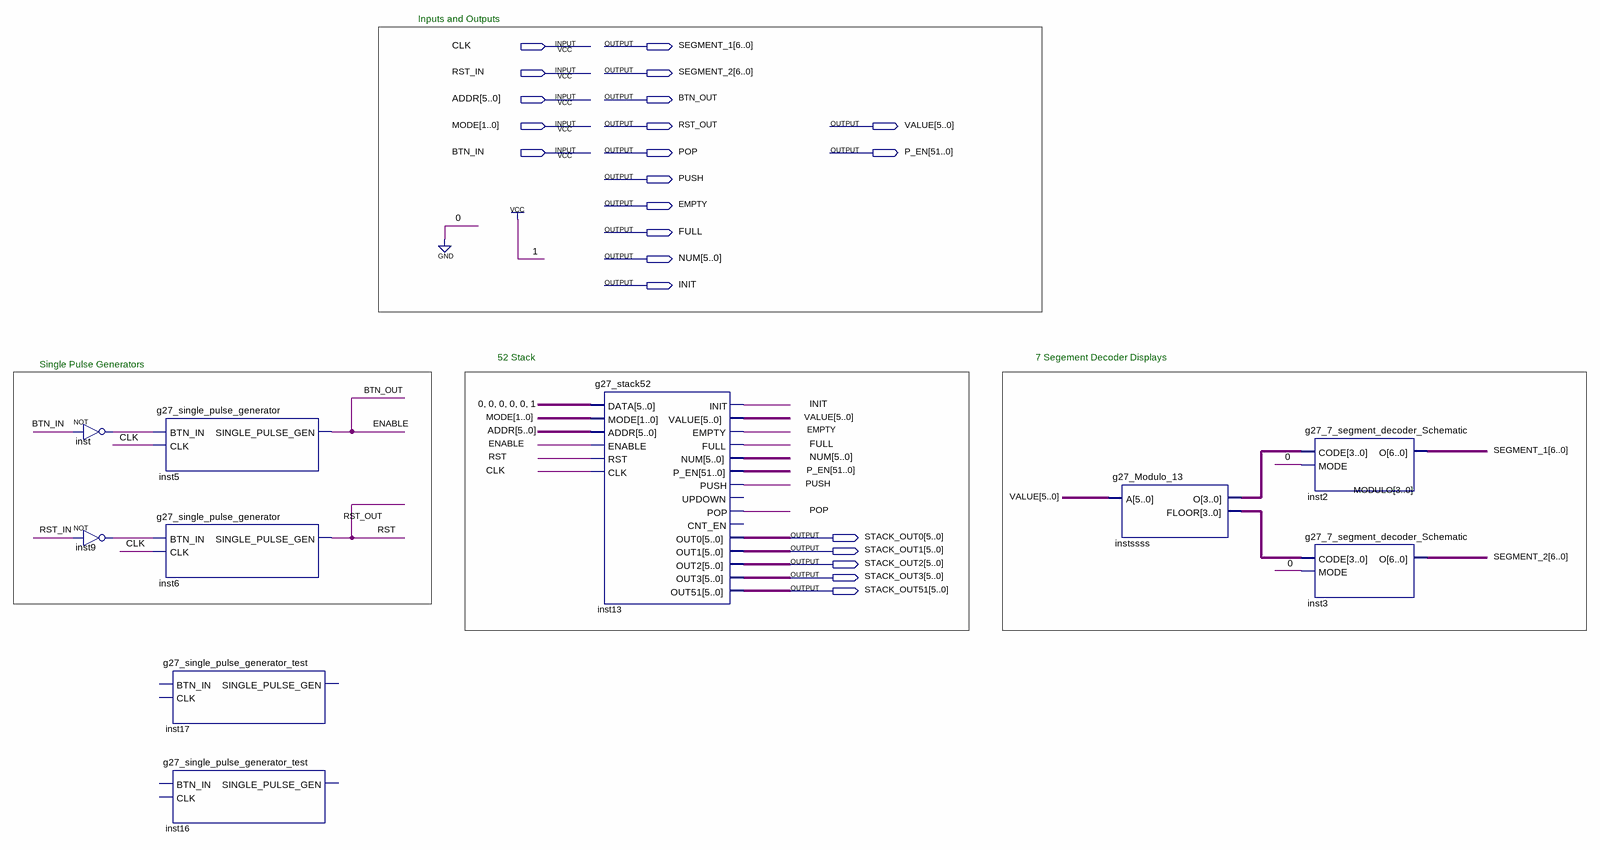
[diagram p0: schematic sheet]
// Quartus schematic g27_test_bed.bdf as structural Verilog: 10 symbols, 22 pins
module g27_test_bed (
  input  CLK,
  input  RST_IN,
  input  [5:0] ADDR,
  input  [1:0] MODE,
  input  BTN_IN,
  output [6:0] SEGMENT_1,
  output [6:0] SEGMENT_2,
  output BTN_OUT,
  output RST_OUT,
  output [5:0] VALUE,
  output POP,
  output [51:0] P_EN,
  output PUSH,
  output EMPTY,
  output FULL,
  output [5:0] NUM,
  output INIT,
  output [5:0] STACK_OUT0,
  output [5:0] STACK_OUT1,
  output [5:0] STACK_OUT2,
  output [5:0] STACK_OUT3,
  output [5:0] STACK_OUT51
);

  wire inst9_out, inst_out;
  wire [3:0] instssss_floor, MODULO;

  not inst (inst_out, BTN_IN);
  not inst9 (inst9_out, RST_IN);
  g27_single_pulse_generator inst5 (.BTN_IN(inst_out), .CLK(CLK), .SINGLE_PULSE_GEN(BTN_OUT));
  g27_single_pulse_generator inst6 (.BTN_IN(inst9_out), .CLK(CLK), .SINGLE_PULSE_GEN(RST_OUT));
  g27_single_pulse_generator_test inst17 ();  // open: BTN_IN, CLK, SINGLE_PULSE_GEN
  g27_single_pulse_generator_test inst16 ();  // open: BTN_IN, CLK, SINGLE_PULSE_GEN
  g27_stack52 inst13 (
    .DATA(6'b000001), .MODE(MODE), .ADDR(ADDR), .ENABLE(BTN_OUT), .RST(RST_OUT), .CLK(CLK), .INIT(INIT),
    .VALUE(VALUE), .EMPTY(EMPTY), .FULL(FULL), .NUM(NUM), .P_EN(P_EN), .PUSH(PUSH), .POP(POP),
    .OUT0(STACK_OUT0), .OUT1(STACK_OUT1), .OUT2(STACK_OUT2), .OUT3(STACK_OUT3), .OUT51(STACK_OUT51));  // open: UPDOWN, CNT_EN
  g27_Modulo_13 instssss (.A(VALUE), .O(MODULO), .FLOOR(instssss_floor));
  g27_7_segment_decoder_Schematic inst2 (.CODE(MODULO), .MODE(1'b0), .O(SEGMENT_1));
  g27_7_segment_decoder_Schematic inst3 (.CODE(instssss_floor), .MODE(1'b0), .O(SEGMENT_2));

  // Other names for the same wires on the sheet: ENABLE = BTN_OUT; RST = RST_OUT

  // Notes on the sheet:
  //   Inputs and Outputs
  //   52 Stack
  //   7 Segement Decoder Displays
  //   Single Pulse Generators
endmodule
